# Altium schematic sheet 01_Block_Diagram.SchDoc
size A4; SheetNumber: 1; SheetTotal: 8
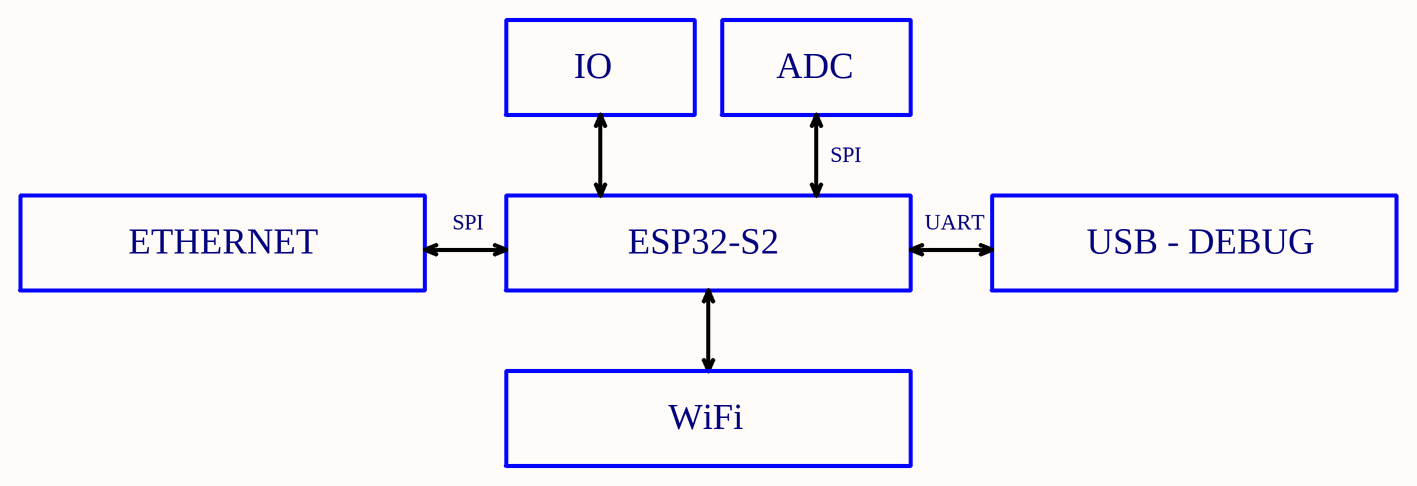
[diagram p0: 01_Block_Diagram.SchDoc]

## Notes on the sheet
- IO
- ADC
- SPI
- ETHERNET
- ESP32-S2
- UART
- USB - DEBUG
- WiFi